# EAGLE schematic MCU (EAGLE 9.5.2)
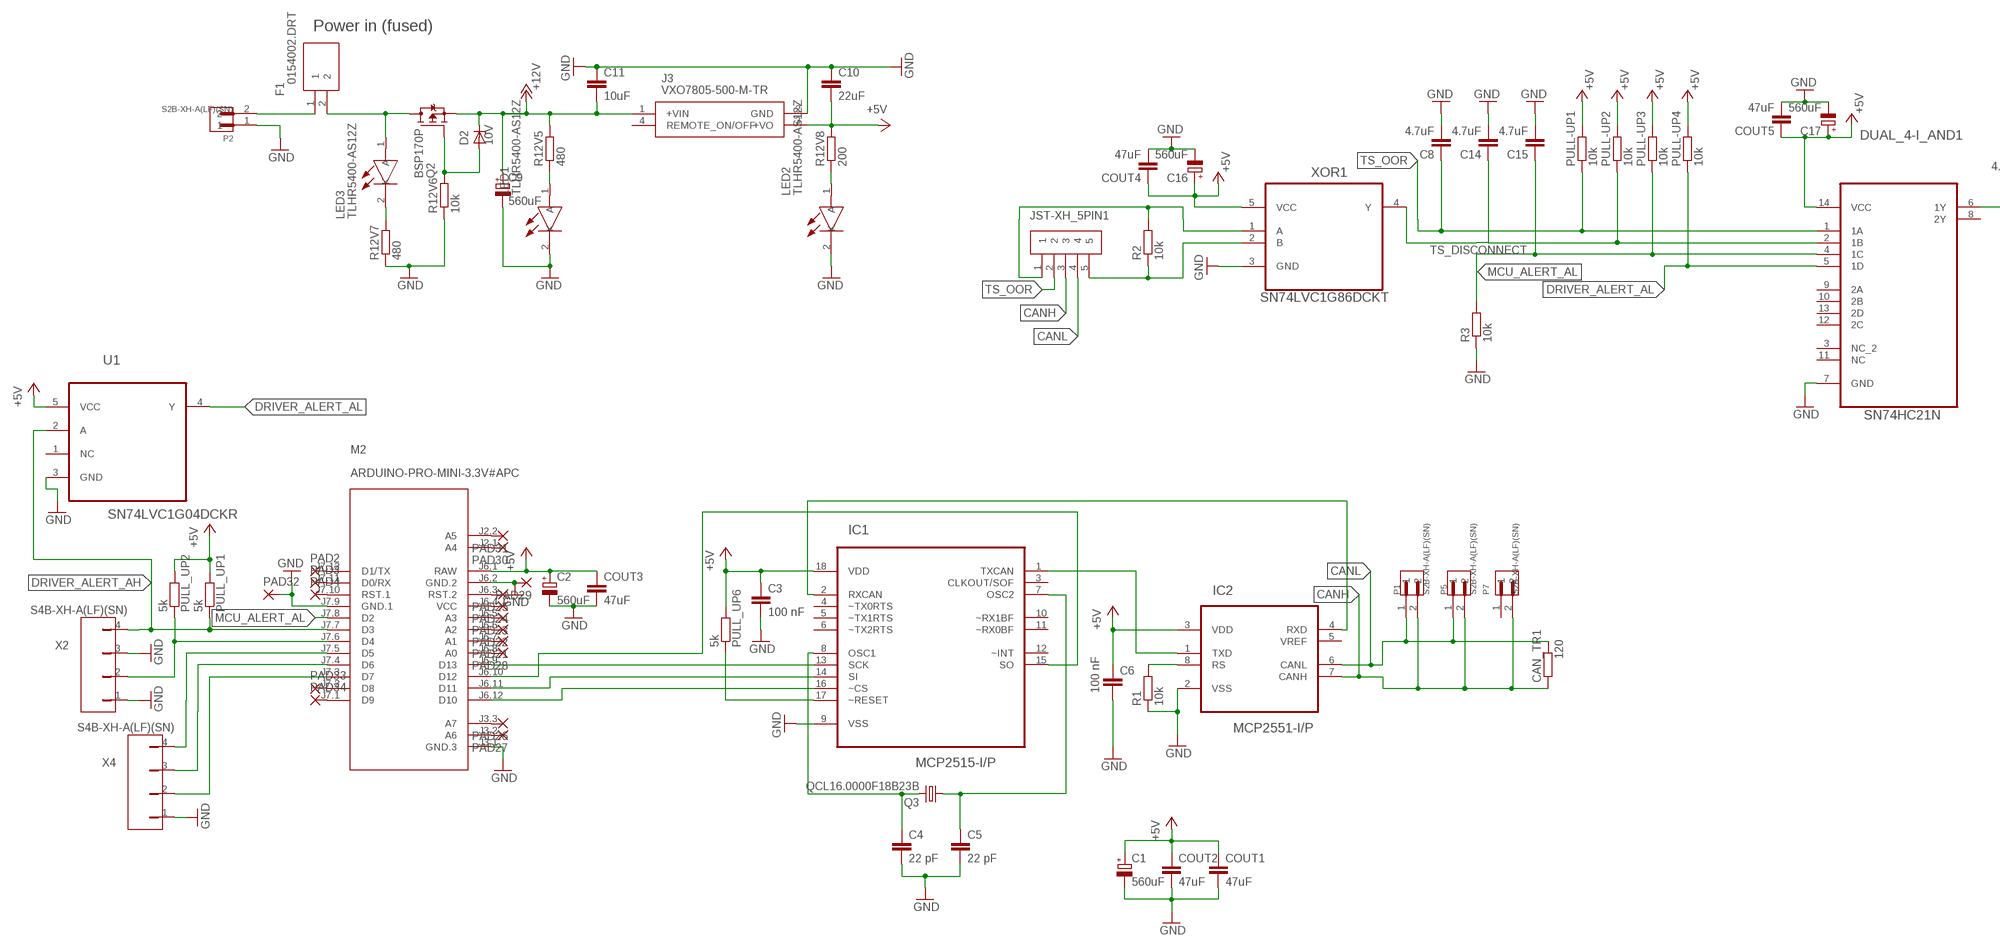
[diagram p0: schematic, sheet 1, part 1 of 2]
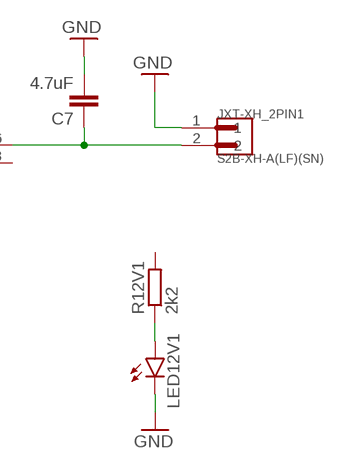
[diagram p1: schematic, sheet 1, part 2 of 2]

## Parts
C1  560uF  CPOL-EUF  [PANASONIC_F]
C2  560uF  CPOL-EUF  [PANASONIC_F]
C3  100 nF  C-EUC0805  [C0805]
C4  22 pF  C-EUC0805  [C0805]
C5  22 pF  C-EUC0805  [C0805]
C6  100 nF  C-EUC0805  [C0805]
C7  4.7uF  C-EUC0805  [C0805]
C8  4.7uF  C-EUC0805  [C0805]
C9  560uF  CPOL-EUF  [PANASONIC_F]
C10  22uF  C-EUC0805  [C0805]
C11  10uF  C-EUC0805  [C0805]
C14  4.7uF  C-EUC0805  [C0805]
C15  4.7uF  C-EUC0805  [C0805]
C16  560uF  CPOL-EUF  [PANASONIC_F]
C17  560uF  CPOL-EUF  [PANASONIC_F]
CAN_TR1  120  R-EU_R0805  [R0805]
COUT1  47uF  C-EUC0805  [C0805]
COUT2  47uF  C-EUC0805  [C0805]
COUT3  47uF  C-EUC0805  [C0805]
COUT4  47uF  C-EUC0805  [C0805]
COUT5  47uF  C-EUC0805  [C0805]
D2  10V  ZENER-DIODESMB  [SMB]
DUAL_4-I_AND1  SN74HC21N  [DIP254P762X508-14]
F1  0154002.DRT  [FUSM9750X381N]
IC1  MCP2515-I/P  [DIP254P762X432-18]
IC2  MCP2551-I/P  [DIP254P762X432-8]
J3  VXO7805-500-M-TR  [VXO7805500MTR]
JST-XH_5PIN1  S5B-XH-A(LF)(SN)  [JST_S5B-XH-A(LF)(SN)]
JXT-XH_2PIN1  S2B-XH-A(LF)(SN)  [JST_S2B-XH-A(LF)(SN)]
LED1  TLHR5400-AS12Z  [TLHR5400AS12Z]
LED2  TLHR5400-AS12Z  [TLHR5400AS12Z]
LED3  TLHR5400-AS12Z  [TLHR5400AS12Z]
LED12V1  LEDCHIPLED_0805  [CHIPLED_0805]
M2  ARDUINO-PRO-MINI-3.3V#APC  [ARDUINO-PRO-MINI#APC]
P1  S2B-XH-A(LF)(SN)  [JST_S2B-XH-A(LF)(SN)]
P2  S2B-XH-A(LF)(SN)  [JST_S2B-XH-A(LF)(SN)]
P5  S2B-XH-A(LF)(SN)  [JST_S2B-XH-A(LF)(SN)]
P7  S2B-XH-A(LF)(SN)  [JST_S2B-XH-A(LF)(SN)]
PAD2  SMD2  [SMD1,27-2,54]
PAD3  SMD2  [SMD1,27-2,54]
PAD4  SMD2  [SMD1,27-2,54]
PAD21  SMD2  [SMD1,27-2,54]
PAD22  SMD2  [SMD1,27-2,54]
PAD23  SMD2  [SMD1,27-2,54]
PAD24  SMD2  [SMD1,27-2,54]
PAD25  SMD2  [SMD1,27-2,54]
PAD26  SMD2  [SMD1,27-2,54]
PAD27  SMD2  [SMD1,27-2,54]
PAD28  SMD2  [SMD1,27-2,54]
PAD29  SMD2  [SMD1,27-2,54]
PAD30  SMD2  [SMD1,27-2,54]
PAD31  SMD2  [SMD1,27-2,54]
PAD32  SMD2  [SMD1,27-2,54]
PAD33  SMD2  [SMD1,27-2,54]
PAD34  SMD2  [SMD1,27-2,54]
PULL-UP1  10k  R-EU_R0805  [R0805]
PULL-UP2  10k  R-EU_R0805  [R0805]
PULL-UP3  10k  R-EU_R0805  [R0805]
PULL-UP4  10k  R-EU_R0805  [R0805]
PULL_UP1  5k  R-EU_R0805  [R0805]
PULL_UP2  5k  R-EU_R0805  [R0805]
PULL_UP6  5k  R-EU_R0805  [R0805]
Q2  BSP170P  [SOT223]
Q3  QCL16.0000F18B23B  CRYSTALHC49S  [HC49/S]
R1  10k  R-EU_R0805  [R0805]
R2  10k  R-EU_R0805  [R0805]
R3  10k  R-EU_R0805  [R0805]
R12V1  2k2  R-EU_R0805  [R0805]
R12V5  480  R-EU_R0805  [R0805]
R12V6  10k  R-EU_R0805  [R0805]
R12V7  480  R-EU_R0805  [R0805]
R12V8  200  R-EU_R0805  [R0805]
U1  SN74LVC1G04DCKR  [SOT65P210X110-5N]
X2  S4B-XH-A(LF)(SN)  [S4B-XH-A(LF)(SN)]
X4  S4B-XH-A(LF)(SN)  [S4B-XH-A(LF)(SN)]
XOR1  SN74LVC1G86DCKT  [SOT65P210X110-5N]

## Nets
+5V [signal]: C1.+ C2.+ C3.1 C6.1 C10.2 C16.+ C17.+ COUT1.1 COUT2.1 COUT3.1 COUT4.1 COUT5.1 DUAL_4-I_AND1.14(VCC) IC1.18(VDD) IC2.3(VDD) J3.3(+VO) M2.J6.1(RAW) PULL-UP1.2 PULL-UP2.2 PULL-UP3.2 PULL-UP4.2 PULL_UP1.2 PULL_UP2.2 PULL_UP6.2 R12V8.2 U1.5(VCC) XOR1.5(VCC)
+12V [12V]: C11.2 J3.1(+VIN) R12V5.2
CANH: CAN_TR1.1 IC2.7(CANH) JST-XH_5PIN1.3 P1.2 P5.2 P7.2
CANL: CAN_TR1.2 IC2.6(CANL) JST-XH_5PIN1.4 P1.1 P5.1
DRIVER_ALERT_AH: M2.J7.7(D3) PULL_UP1.1 U1.2(A) X2.4
DRIVER_ALERT_AL: DUAL_4-I_AND1.5(1D) PULL-UP4.1 U1.4(Y)
GND: C1.- C2.- C3.2 C4.2 C5.2 C6.2 C7.2 C8.2 C9.- C10.1 C11.1 C14.2 C15.2 C16.- C17.- COUT1.2 COUT2.2 COUT3.2 COUT4.2 COUT5.2 DUAL_4-I_AND1.7(GND) IC1.9(VSS) IC2.2(VSS) J3.2(GND) JXT-XH_2PIN1.1 LED1.2(K) LED2.2(K) LED12V1.C M2.J3.1(GND.3) M2.J6.2(GND.2) M2.J7.9(GND.1) P2.1 PAD29.1(P) PAD32.1(P) R1.1 R3.1 R12V6.1 R12V7.1 U1.3(GND) X2.1 X2.3 X4.1 XOR1.3(GND)
MCU_ALERT_AL: C15.1 DUAL_4-I_AND1.4(1C) M2.J7.8(D2) PULL-UP3.1 R3.2
N$3: M2.J7.12(D1/TX) PAD2.1(P)
N$4: M2.J7.11(D0/RX) PAD3.1(P)
N$5 [12V]: D2.A Q2.1(G) R12V6.2
N$6: F1.1 P2.2
N$7: F1.2 LED3.1(A) Q2.2(D) Q2.4(D)
N$8: M2.J7.10(RST.1) PAD4.1(P)
N$9: M2.J6.7(A1) PAD21.1(P)
N$10: M2.J6.6(A2) PAD22.1(P)
N$11: M2.J6.5(A3) PAD23.1(P)
N$12: M2.J6.4(VCC) PAD24.1(P)
N$13: IC1.15(SO) M2.J6.10(D12)
N$14: M2.J6.3(RST.2) PAD25.1(P)
N$15 [12V]: C9.+ D2.C Q2.3(S)
N$16: LED3.2(K) R12V7.2
N$17: M2.J3.3(A7) PAD26.1(P)
N$18: LED1.1(A) R12V5.1
N$19: LED2.1(A) R12V8.1
N$20: IC1.13(SCK) M2.J6.9(D13)
N$21: IC1.14(SI) M2.J6.11(D11)
N$22: IC1.16(~CS) M2.J6.12(D10)
N$40: M2.J3.2(A6) PAD27.1(P)
N$41: M2.J6.8(A0) PAD28.1(P)
N$42: M2.J2.1(A4) PAD30.1(P)
N$49: M2.J2.2(A5) PAD31.1(P)
N$50: M2.J7.6(D4) PULL_UP2.1 X2.2
N$51: M2.J7.5(D5) X4.4
N$52: M2.J7.4(D6) X4.3
N$53: M2.J7.3(D7) X4.2
N$54: M2.J7.2(D8) PAD33.1(P)
N$55: M2.J7.1(D9) PAD34.1(P)
N$56: IC1.17(~RESET) PULL_UP6.1
N$58: C4.1 IC1.8(OSC1) Q3.2
N$59: C5.1 IC1.7(OSC2) Q3.1
N$60: IC2.8(RS) R1.2
N$62: IC1.2(RXCAN) IC2.4(RXD)
N$63 [signal]: JST-XH_5PIN1.1 R2.2 XOR1.1(A)
N$64 [12V]: C7.1 DUAL_4-I_AND1.6(1Y) JXT-XH_2PIN1.2
N$65: LED12V1.A R12V1.1
N$66: JST-XH_5PIN1.2
N$67: JST-XH_5PIN1.5 R2.1 XOR1.2(B)
N$68: IC1.1(TXCAN) IC2.1(TXD)
TS_DISCONNECT: C14.1 DUAL_4-I_AND1.2(1B) PULL-UP2.1 XOR1.4(Y)
TS_OOR: C8.1 DUAL_4-I_AND1.1(1A) PULL-UP1.1
Unconnected: DUAL_4-I_AND1.3(NC_2) DUAL_4-I_AND1.8(2Y) DUAL_4-I_AND1.9(2A) DUAL_4-I_AND1.10(2B) DUAL_4-I_AND1.11(NC) DUAL_4-I_AND1.12(2C) DUAL_4-I_AND1.13(2D) IC1.3(CLKOUT/SOF) IC1.4(~TX0RTS) IC1.5(~TX1RTS) IC1.6(~TX2RTS) IC1.10(~RX1BF) IC1.11(~RX0BF) IC1.12(~INT) IC2.5(VREF) J3.4(REMOTE_ON/OFF) P7.1 R12V1.2 U1.1(NC)

## Notes on the sheet
- Power in (fused)

## Library data of the parts
C1 C2 C9 C16 C17 = rcl:CPOL-EU: POLARIZED CAPACITOR, European symbol; SPICEPREFIX: C
C3-C8 C10 C11 C14 C15 COUT1-COUT5 = rcl:C-EU: CAPACITOR, European symbol; SPICEPREFIX: C
CAN_TR1 PULL-UP1-PULL-UP4 PULL_UP1 PULL_UP2 PULL_UP6 R1-R3 R12V1 R12V5-R12V8 = rcl:R-EU_: RESISTOR, European symbol; SPICEPREFIX: R
D2 = diode:ZENER-DIODE: Z-Diode
DUAL_4-I_AND1 = SN74HC21N:SN74HC21N: DUAL 4-IN POS AND GATES; AVAILABILITY: Unavailable; DESCRIPTION: AND Gate IC 2 Channel 14-PDIP; MF: Texas Instruments; MP: SN74HC21N; PACKAGE: DIP-14 Texas Instruments; PRICE: None
F1 = 0154002.DRT:0154002.DRT: Littelfuse 2A T Surface Mount Fuse, 125V ac/dc Source: Datasheet; DESCRIPTION: Littelfuse 2A T Surface Mount Fuse, 125V ac/dc; HEIGHT: 3.81mm; MANUFACTURER_NAME: LITTELFUSE; MANUFACTURER_PART_NUMBER: 0154002.DRT; MOUSER_PART_NUMBER: 576-0154002.DRT; MOUSER_PRICE-STOCK: https://www.mouser.co.uk/ProductDetail/Littelfuse/0154002DRT?qs=2VFNtWizgicDQ8R7JxIsmA%3D%3D
IC1 = MCP2515-I_P:MCP2515-I/P: Stand-Alone CAN Controller; AVAILABILITY: Unavailable; DESCRIPTION: MCP2515 Series 5.5 V 1 Mb/s Stand Alone SPI Interface CAN Controller - PDIP-18; MF: Microchip; MP: MCP2515-I/P; PACKAGE: DIP-18 Microchip; PRICE: None
IC2 = MCP2551-I_P:MCP2551-I/P: High-Speed CAN Transceiver; AVAILABILITY: Unavailable; DESCRIPTION: MCP2551 Series 5.5 V 1 Mb/s Surface Mount High-Speed CAN Transceiver - PDIP-8; MF: Microchip; MP: MCP2551-I/P; PACKAGE: DIP-8 Microchip; PRICE: None
J3 = VXO7805-500-M-TR:VXO7805-500-M-TR: Module DC-DC 24VIN 1-OUT 5V 0.5A 2.5W 4-Pin SMD Module T/R Source: Datasheet; DESCRIPTION: Module DC-DC 24VIN 1-OUT 5V 0.5A 2.5W 4-Pin SMD Module T/R; HEIGHT: 3.5mm; MANUFACTURER_NAME: CUI Inc; MANUFACTURER_PART_NUMBER: VXO7805-500-M-TR; MOUSER_PART_NUMBER: 490-VXO7805-500-M-TR; MOUSER_PRICE-STOCK: https://www.mouser.co.uk/ProductDetail/CUI-Inc/VXO7805-500-M-TR?qs=GBLSl2AkirsIOUn2Flq1hQ%3D%3D
JST-XH_5PIN1 = S5B-XH-A_LF__SN_:S5B-XH-A(LF)(SN): XH Connector 2.5mm pitch/Disconnectable Crimp Style Connector; AVAILABILITY: Unavailable; DESCRIPTION: Connector Header Through Hole, Right Angle 5 position 0.098 _2.50mm_; MF: JST Sales; MP: S5B-XH-A_LF__SN_; PACKAGE: None; PRICE: None
JXT-XH_2PIN1 P1 P2 P5 P7 = S2B-XH-A_LF__SN_:S2B-XH-A(LF)(SN): XH Series 2.5mm 2 Position Through Hole Shrouded Header Connector; DESCRIPTION: Connector Header Through Hole, Right Angle 2 position 0.098 _2.50mm_; DIGI-KEY_PART_NUMBER: 455-2257-ND; DIGI-KEY_PURCHASE_URL: https://www.digikey.com/product-detail/en/jst-sales-america-inc/S2B-XH-A_LF__SN_/455-2257-ND/1651055?utm_source=snapeda&utm_medium=aggregator&utm_campaign=symbol; MF: JST Sales; MP: S2B-XH-A_LF__SN_; PACKAGE: None
LED1-LED3 = SamacSys_Parts:TLHR5400-AS12Z: Standard LEDs - Through Hole Red 10mcd; 5mm 612-625nm; 2V Typ Source: Datasheet <http://www.vishay.com/docs/83012/tlhg540.pdf>; DESCRIPTION: Standard LEDs - Through Hole Red 10mcd; 5mm 612-625nm; 2V Typ; HEIGHT: 12.8mm; MANUFACTURER_NAME: Vishay; MANUFACTURER_PART_NUMBER: TLHR5400-AS12Z; MOUSER_PART_NUMBER: 78-TLHR5400-AS12Z; MOUSER_PRICE-STOCK: https://www.mouser.co.uk/ProductDetail/Vishay-Semiconductors/TLHR5400-AS12Z?qs=nQ9vpdMXC6Dc4iRzpr4t7Q%3D%3D
LED12V1 = led:LED: LED OSRAM: - CHIPLED LG R971, LG N971, LY N971, LG Q971, LY Q971, LO R971, LY R971 LH N974, LH R974 LS Q976, LO Q976, LY Q976 LO Q996 - Hyper CHIPLED LW Q18S LB Q993, LB Q99A, LB R99A - SideLED LS A670, LO A670, LY A670, LG A670, LP A670 LB A673, LV A673, LT A673, LW A673 LH A674 LY A675 LS A676, LA A676, LO A676, LY A676, LW A676 LS A679, LY A679, LG A679 - Hyper Micro SIDELED® LS Y876, LA Y876, LO Y876, LY Y876 LT Y87S - SmartLED LW L88C, LW L88S LB L89C, LB L89S, LG L890 LS L89K, LO L89K, LY L89K LS L896, LA L896, LO L896, LY L896 - TOPLED LS T670, LO T670, LY T670, LG T670, LP T670 LSG T670, LSP T670, LSY T670, LOP T670, LYG T670 LG T671, LOG T671, LSG T671 LB T673, LV T673, LT T673, LW T673 LH T674 LS T676, LA T676, LO T676, LY T676, LB T676, LH T676, LSB T676, LW T676 LB T67C, LV T67C, LT T67C, LS T67K, LO T67K, LY T67K, LW E67C LS E67B, LA E67B, LO E67B, LY E67B, LB E67C, LV E67C, LT E67C LW T67C LS T679, LY T679, LG T679 LS T770, LO T770, LY T770, LG T770, LP T770 LB T773, LV T773, LT T773, LW T773 LH T774 LS E675, LA E675, LY E675, LS T675 LS T776, LA T776, LO T776, LY T776, LB T776 LHGB T686 LT T68C, LB T68C - Hyper Mini TOPLED® LB M676 - Mini TOPLED Santana® LG M470 LS M47K, LO M47K, LY M47K Source: http://www.osram.convergy.de LUXEON: - LUMILED® LXK2-PW12-R00, LXK2-PW12-S00, LXK2-PW14-U00, LXK2-PW14-V00 LXK2-PM12-R00, LXK2-PM12-S00, LXK2-PM14-U00 LXK2-PE12-Q00, LXK2-PE12-R00, LXK2-PE12-S00, LXK2-PE14-T00, LXK2-PE14-U00 LXK2-PB12-K00, LXK2-PB12-L00, LXK2-PB12-M00, LXK2-PB14-N00, LXK2-PB14-P00, LXK2-PB14-Q00 LXK2-PR12-L00, LXK2-PR12-M00, LXK2-PR14-Q00, LXK2-PR14-R00 LXK2-PD12-Q00, LXK2-PD12-R00, LXK2-PD12-S00 LXK2-PH12-R00, LXK2-PH12-S00 LXK2-PL12-P00, LXK2-PL12-Q00, LXK2-PL12-R00 Source: www.luxeon.com KINGBRIGHT: KA-3528ASYC Source: www.kingbright.com
M2 = diy-modules:ARDUINO-PRO-MINI-*#APC: Arduino Pro Mini (and compatible devices) with angle programming connector More details available here: https://www.arduino.cc/en/Main/ArduinoBoardProMini Click here to find device on ebay.com <http://www.ebay.com/sch/arduino+pro+mini>
PAD2-PAD4 PAD21-PAD34 = wirepad:SMD2: SMD PAD
Q2 = transistor-fet:BSP170P: SIPMOS(R) Small-Signal-Transistor P-Channel, Enhancement mode Source: http://www.infineon.com/upload/Document/BSP170P_Rev2.4.pdf
Q3 = adafruit:CRYSTAL: CRYSTAL; OC_FARNELL: 1667008; OC_NEWARK: unknown
U1 = SN74LVC1G04DCKR:SN74LVC1G04DCKR: SINGLE INVERTER GATE; AVAILABILITY: Unavailable; DESCRIPTION: IC INVERTER 1CH 1-INP SC70-5; MF: Texas Instruments; MP: SN74LVC1G04DCKR; PACKAGE: SC-70-5 Texas Instruments; PRICE: None
X2 X4 = S4B-XH-A_LF__SN_:S4B-XH-A(LF)(SN): http://octopart.com/s4b-xh-a%28lf%29%28sn%29-jst-7995347; AVAILABILITY: Unavailable; DESCRIPTION: Connector Header Through Hole, Right Angle 4 position 0.098 _2.50mm_; MF: JST Sales; MP: S4B-XH-A_LF__SN_; PACKAGE: None; PRICE: None
XOR1 = SN74LVC1G86DCKT:SN74LVC1G86DCKT: SINGLE 2-INPUT EXCLUSIVE-OR GATE; AVAILABILITY: Unavailable; DESCRIPTION: XOR _Exclusive OR_ IC 1 Channel SC-70-5; MF: Texas Instruments; MP: SN74LVC1G86DCK; PACKAGE: None; PRICE: None

## Net classes
1 signal: width 0.3 mm, drill 0.4 mm, clearance 0.25 mm
2 12V: width 1 mm, drill 1.1 mm, clearance 0.25 mm